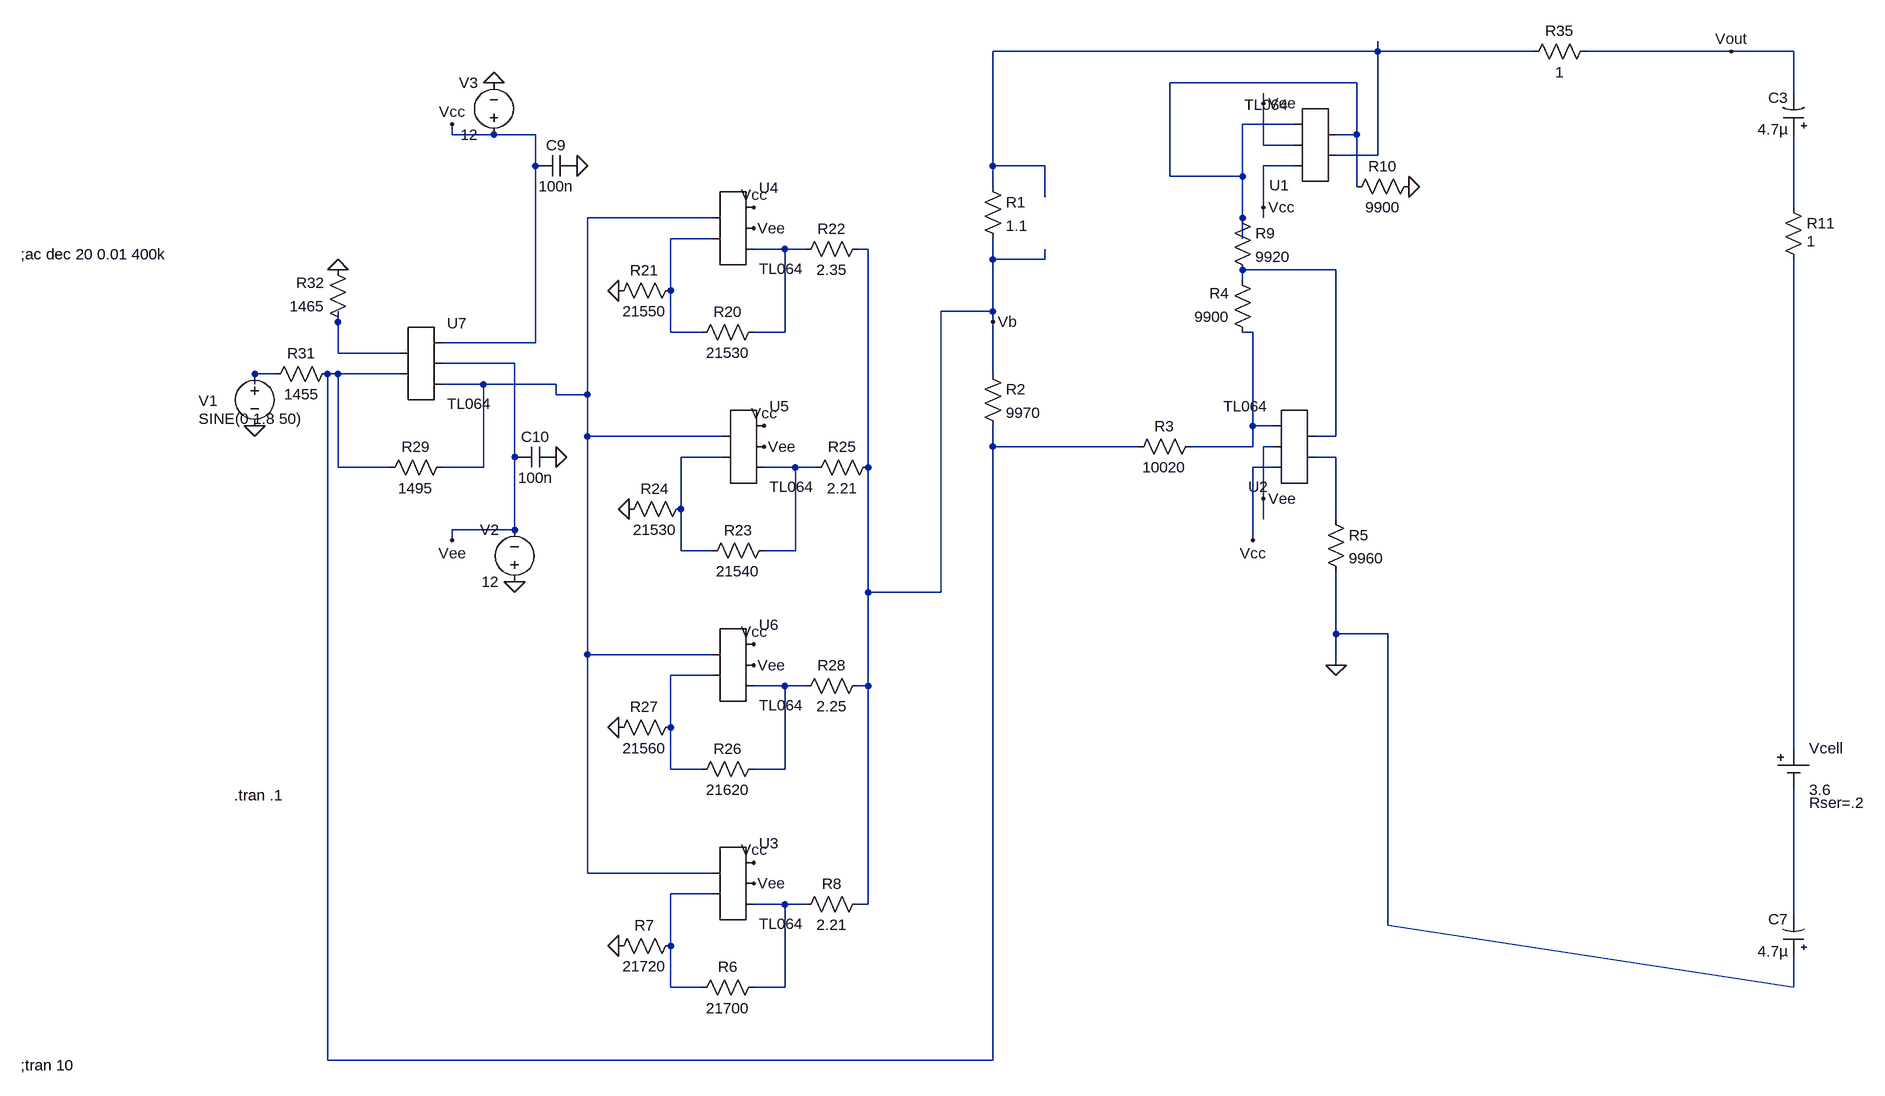
[diagram p0: schematic eis_frontend_ltspice_model.asc]
eis_frontend_ltspice_model.asc, the LTspice schematic file:
Version 4
SHEET 1 2468 1000
WIRE 512 -576 512 -592
WIRE 512 -576 -80 -576
WIRE 752 -576 512 -576
WIRE 1056 -576 832 -576
WIRE 1152 -576 1056 -576
WIRE 480 -528 192 -528
WIRE 1152 -512 1152 -576
WIRE 336 -496 336 -512
WIRE 384 -464 304 -464
WIRE -912 -448 -912 -464
WIRE -848 -448 -912 -448
WIRE -784 -448 -848 -448
WIRE 480 -448 480 -528
WIRE 480 -448 448 -448
WIRE 336 -432 336 -496
WIRE 384 -432 336 -432
WIRE 512 -416 512 -576
WIRE 512 -416 448 -416
WIRE -784 -400 -784 -448
WIRE -80 -400 -80 -576
WIRE 0 -400 -80 -400
WIRE 384 -400 336 -400
WIRE 192 -384 192 -528
WIRE 304 -384 304 -464
WIRE 304 -384 192 -384
WIRE -80 -368 -80 -400
WIRE 480 -368 480 -448
WIRE 0 -352 0 -400
WIRE 336 -336 336 -400
WIRE 1152 -336 1152 -448
WIRE -512 -320 -704 -320
WIRE 304 -320 304 -384
WIRE 336 -320 336 -336
WIRE -512 -288 -576 -288
WIRE 304 -288 304 -320
WIRE -400 -272 -448 -272
WIRE -368 -272 -400 -272
WIRE -272 -272 -288 -272
WIRE -80 -256 -80 -288
WIRE 0 -256 0 -272
WIRE 0 -256 -80 -256
WIRE 448 -240 304 -240
WIRE 304 -224 304 -240
WIRE -576 -208 -576 -288
WIRE -80 -176 -80 -256
WIRE -80 -176 -160 -176
WIRE -1088 -160 -1088 -176
WIRE -80 -160 -80 -176
WIRE -576 -144 -576 -208
WIRE -528 -144 -576 -144
WIRE -400 -144 -400 -272
WIRE -400 -144 -448 -144
WIRE 320 -144 304 -144
WIRE -784 -128 -784 -400
WIRE -784 -128 -928 -128
WIRE -1088 -112 -1088 -160
WIRE -992 -112 -1088 -112
WIRE -816 -96 -928 -96
WIRE -1184 -80 -1216 -80
WIRE -1088 -80 -1104 -80
WIRE -992 -80 -1088 -80
WIRE -80 -80 -80 -160
WIRE -1216 -64 -1216 -80
WIRE -864 -64 -928 -64
WIRE -752 -64 -864 -64
WIRE -752 -48 -752 -64
WIRE -704 -48 -704 -320
WIRE -704 -48 -752 -48
WIRE 320 0 320 -144
WIRE 352 0 320 0
WIRE -704 16 -704 -48
WIRE -496 16 -704 16
WIRE 448 16 448 -240
WIRE 448 16 416 16
WIRE -80 32 -80 0
WIRE 144 32 -80 32
WIRE 320 32 320 0
WIRE 320 32 224 32
WIRE 352 32 336 32
WIRE -816 48 -816 -96
WIRE -496 48 -560 48
WIRE 448 48 416 48
WIRE -1088 64 -1088 -80
WIRE -1008 64 -1088 64
WIRE -864 64 -864 -64
WIRE -864 64 -928 64
WIRE -384 64 -432 64
WIRE -352 64 -384 64
WIRE -272 64 -272 -272
WIRE 352 64 320 64
WIRE 336 112 336 32
WIRE -560 128 -560 48
WIRE 336 144 336 112
WIRE 448 144 448 48
WIRE -816 160 -816 48
WIRE -816 160 -912 160
WIRE -912 176 -912 160
WIRE 320 176 320 64
WIRE -560 192 -560 128
WIRE -512 192 -560 192
WIRE -384 192 -384 64
WIRE -384 192 -432 192
WIRE -272 256 -272 64
WIRE -160 256 -160 -176
WIRE -160 256 -272 256
WIRE 448 320 448 224
WIRE 528 320 448 320
WIRE -704 352 -704 16
WIRE -512 352 -704 352
WIRE 448 368 448 320
WIRE -512 384 -576 384
WIRE -400 400 -448 400
WIRE -368 400 -400 400
WIRE -272 400 -272 256
WIRE -272 400 -288 400
WIRE -576 464 -576 384
WIRE 1152 496 1152 -256
WIRE -576 528 -576 464
WIRE -528 528 -576 528
WIRE -400 528 -400 400
WIRE -400 528 -448 528
WIRE -704 688 -704 352
WIRE -512 688 -704 688
WIRE -512 720 -576 720
WIRE -400 736 -448 736
WIRE -368 736 -400 736
WIRE -272 736 -272 400
WIRE -272 736 -288 736
WIRE 1152 752 1152 560
WIRE 528 768 528 320
WIRE -576 800 -576 720
WIRE -576 864 -576 800
WIRE -528 864 -576 864
WIRE -400 864 -400 736
WIRE -400 864 -448 864
WIRE 1152 864 528 768
WIRE 1152 864 1152 816
WIRE -1104 976 -1104 -80
WIRE -80 976 -80 32
WIRE -80 976 -1104 976
FLAG 448 368 0
FLAG -80 -160 Vb
FLAG -912 -464 Vcc
FLAG -912 176 Vee
FLAG 336 -336 Vcc
FLAG 320 176 Vcc
FLAG 336 -496 Vee
FLAG 336 112 Vee
FLAG -656 800 0
FLAG -1216 0 0
FLAG -848 -528 0
FLAG -816 240 0
FLAG -448 672 Vcc
FLAG -448 704 Vee
FLAG 560 -368 0
FLAG -656 -208 0
FLAG -448 -336 Vcc
FLAG -448 -304 Vee
FLAG -640 128 0
FLAG -432 0 Vcc
FLAG -432 32 Vee
FLAG -656 464 0
FLAG -448 336 Vcc
FLAG -448 368 Vee
FLAG -1088 -240 0
FLAG -720 -400 0
FLAG -752 48 0
FLAG 1056 -576 Vout
SYMBOL res -96 -384 R0
SYMATTR InstName R1
SYMATTR Value 1.1
SYMBOL res -96 -96 R0
SYMATTR InstName R2
SYMATTR Value 9970
SYMBOL res 240 16 R90
WINDOW 0 0 56 VBottom 2
WINDOW 3 32 56 VTop 2
SYMATTR InstName R3
SYMATTR Value 10020
SYMBOL res 320 -128 R180
WINDOW 0 36 76 Left 2
WINDOW 3 36 40 Left 2
SYMATTR InstName R4
SYMATTR Value 9900
SYMBOL res 432 128 R0
SYMATTR InstName R5
SYMATTR Value 9960
SYMBOL AutoGenerated\\TL064 416 -432 R180
SYMATTR InstName U1
SYMBOL AutoGenerated\\TL064 384 32 R180
SYMATTR InstName U2
SYMBOL res -432 848 R90
WINDOW 0 0 56 VBottom 2
WINDOW 3 32 56 VTop 2
SYMATTR InstName R6
SYMATTR Value 21700
SYMBOL res -560 784 R90
WINDOW 0 0 56 VBottom 2
WINDOW 3 32 56 VTop 2
SYMATTR InstName R7
SYMATTR Value 21720
SYMBOL res -272 720 R90
WINDOW 0 0 56 VBottom 2
WINDOW 3 32 56 VTop 2
SYMATTR InstName R8
SYMATTR Value 2.21
SYMBOL voltage -1216 -96 R0
WINDOW 3 -86 85 Left 2
WINDOW 123 -86 85 Left 2
WINDOW 39 0 0 Left 0
WINDOW 0 -86 57 Left 2
SYMATTR Value SINE(0 1.8 50)
SYMATTR InstName V1
SYMBOL voltage -816 256 R180
WINDOW 0 24 96 Left 2
WINDOW 3 24 16 Left 2
WINDOW 123 0 0 Left 0
WINDOW 39 0 0 Left 0
SYMATTR InstName V2
SYMATTR Value 12
SYMBOL voltage -848 -432 R180
WINDOW 0 24 96 Left 2
WINDOW 3 24 16 Left 2
WINDOW 123 0 0 Left 0
WINDOW 39 0 0 Left 0
SYMATTR InstName V3
SYMATTR Value 12
SYMBOL res 288 -336 R0
SYMATTR InstName R9
SYMATTR Value 9920
SYMBOL res 576 -384 R90
WINDOW 0 0 56 VBottom 2
WINDOW 3 32 56 VTop 2
SYMATTR InstName R10
SYMATTR Value 9900
SYMBOL res 1136 -352 R0
WINDOW 3 36 68 Left 2
SYMATTR Value 1
SYMATTR InstName R11
SYMBOL AutoGenerated\\TL064 -480 704 R0
SYMATTR InstName U3
SYMBOL res -432 -160 R90
WINDOW 0 0 56 VBottom 2
WINDOW 3 32 56 VTop 2
SYMATTR InstName R20
SYMATTR Value 21530
SYMBOL res -560 -224 R90
WINDOW 0 0 56 VBottom 2
WINDOW 3 32 56 VTop 2
SYMATTR InstName R21
SYMATTR Value 21550
SYMBOL res -272 -288 R90
WINDOW 0 0 56 VBottom 2
WINDOW 3 32 56 VTop 2
SYMATTR InstName R22
SYMATTR Value 2.35
SYMBOL AutoGenerated\\TL064 -480 -304 R0
SYMATTR InstName U4
SYMBOL res -416 176 R90
WINDOW 0 0 56 VBottom 2
WINDOW 3 32 56 VTop 2
SYMATTR InstName R23
SYMATTR Value 21540
SYMBOL res -544 112 R90
WINDOW 0 0 56 VBottom 2
WINDOW 3 32 56 VTop 2
SYMATTR InstName R24
SYMATTR Value 21530
SYMBOL res -256 48 R90
WINDOW 0 0 56 VBottom 2
WINDOW 3 32 56 VTop 2
SYMATTR InstName R25
SYMATTR Value 2.21
SYMBOL AutoGenerated\\TL064 -464 32 R0
SYMATTR InstName U5
SYMBOL res -432 512 R90
WINDOW 0 0 56 VBottom 2
WINDOW 3 32 56 VTop 2
SYMATTR InstName R26
SYMATTR Value 21620
SYMBOL res -560 448 R90
WINDOW 0 0 56 VBottom 2
WINDOW 3 32 56 VTop 2
SYMATTR InstName R27
SYMATTR Value 21560
SYMBOL res -272 384 R90
WINDOW 0 0 56 VBottom 2
WINDOW 3 32 56 VTop 2
SYMATTR InstName R28
SYMATTR Value 2.25
SYMBOL AutoGenerated\\TL064 -480 368 R0
SYMATTR InstName U6
SYMBOL AutoGenerated\\TL064 -960 -96 R0
SYMATTR InstName U7
SYMBOL res -912 48 R90
WINDOW 0 0 56 VBottom 2
WINDOW 3 32 56 VTop 2
SYMATTR InstName R29
SYMATTR Value 1495
SYMBOL polcap 1168 -448 R180
WINDOW 0 24 57 Left 2
WINDOW 3 24 8 Left 2
SYMATTR InstName C3
SYMATTR Value 4.7µ
SYMATTR Description Capacitor
SYMATTR Type cap
SYMATTR SpiceLine V=25 Irms=13m Rser=1.5 Lser=550f mfg="Würth Elektronik" pn="865230440001 WCAP-AS5H 4.3x4.3" type="Al electrolytic"
SYMBOL res -1088 -96 R90
WINDOW 0 0 56 VBottom 2
WINDOW 3 32 56 VTop 2
SYMATTR InstName R31
SYMATTR Value 1455
SYMBOL res -1072 -144 R180
WINDOW 0 36 76 Left 2
WINDOW 3 36 40 Left 2
SYMATTR InstName R32
SYMATTR Value 1465
SYMBOL Misc\\cell 1152 496 R0
WINDOW 123 0 0 Left 0
WINDOW 39 24 84 Left 2
SYMATTR SpiceLine Rser=.2
SYMATTR InstName Vcell
SYMATTR Value 3.6
SYMBOL polcap 1168 816 R180
WINDOW 0 24 57 Left 2
WINDOW 3 24 8 Left 2
SYMATTR InstName C7
SYMATTR Value 4.7µ
SYMATTR Description Capacitor
SYMATTR Type cap
SYMATTR SpiceLine V=25 Irms=13m Rser=1.5 Lser=550f mfg="Würth Elektronik" pn="865230440001 WCAP-AS5H 4.3x4.3" type="Al electrolytic"
SYMBOL res 848 -592 R90
WINDOW 0 0 56 VBottom 2
WINDOW 3 32 56 VTop 2
SYMATTR InstName R35
SYMATTR Value 1
SYMBOL cap -720 -416 R90
WINDOW 0 0 32 VBottom 2
WINDOW 3 32 32 VTop 2
SYMATTR InstName C9
SYMATTR Value 100n
SYMBOL cap -752 32 R90
WINDOW 0 0 32 VBottom 2
WINDOW 3 32 32 VTop 2
SYMATTR InstName C10
SYMATTR Value 100n
TEXT -1248 568 Left 2 !.tran .1
TEXT -1576 -264 Left 2 !;ac dec 20 0.01 400k
TEXT -1576 984 Left 2 !;tran 10

The netlist it stands for:
* eis_frontend_ltspice_model.asc
R1 N001 Vb 1.1
R2 Vb N011 9970
R3 N009 N011 10020
R4 N009 N007 9900
R5 N013 0 9960
* U1: TL064 (symbol AutoGenerated\TL064 not available, pins judged from their places): pin1=N001 pin2=N002 pin3=Vcc pin4=Vee pin5=N002
* U2: TL064 (symbol AutoGenerated\TL064 not available, pins judged from their places): pin1=N013 pin2=N007 pin3=Vcc pin4=Vee pin5=N009
R6 N019 N018 21700
R7 N018 0 21720
R8 Vb N019 2.21
V1 N010 0 SINE(0 1.8 50)
V2 0 Vee 12
V3 Vcc 0 12
R9 N002 N007 9920
R10 0 N002 9900
R11 N003 N017 1
* U3: TL064 (symbol AutoGenerated\TL064 not available, pins judged from their places): pin1=N004 pin2=N018 pin3=Vcc pin4=Vee pin5=N019
R20 N006 N005 21530
R21 N005 0 21550
R22 Vb N006 2.35
* U4: TL064 (symbol AutoGenerated\TL064 not available, pins judged from their places): pin1=N004 pin2=N005 pin3=Vcc pin4=Vee pin5=N006
R23 N014 N012 21540
R24 N012 0 21530
R25 Vb N014 2.21
* U5: TL064 (symbol AutoGenerated\TL064 not available, pins judged from their places): pin1=N004 pin2=N012 pin3=Vcc pin4=Vee pin5=N014
R26 N016 N015 21620
R27 N015 0 21560
R28 Vb N016 2.25
* U6: TL064 (symbol AutoGenerated\TL064 not available, pins judged from their places): pin1=N004 pin2=N015 pin3=Vcc pin4=Vee pin5=N016
* U7: TL064 (symbol AutoGenerated\TL064 not available, pins judged from their places): pin1=N008 pin2=N011 pin3=Vcc pin4=Vee pin5=N004
R29 N004 N011 1495
C3 N003 Vout 4.7µ V=25 Irms=13m Rser=1.5 Lser=550f mfg="Würth Elektronik" pn="865230440001 WCAP-AS5H 4.3x4.3" type="Al electrolytic"
R31 N011 N010 1455
R32 N008 0 1465
Vcell N017 N020 3.6 Rser=.2
C7 0 N020 4.7µ V=25 Irms=13m Rser=1.5 Lser=550f mfg="Würth Elektronik" pn="865230440001 WCAP-AS5H 4.3x4.3" type="Al electrolytic"
R35 Vout N001 1
C9 0 Vcc 100n
C10 0 Vee 100n
.tran .1
;ac dec 20 0.01 400k
;tran 10
.backanno
.end